# Altium project TASR1000.PrjPcb
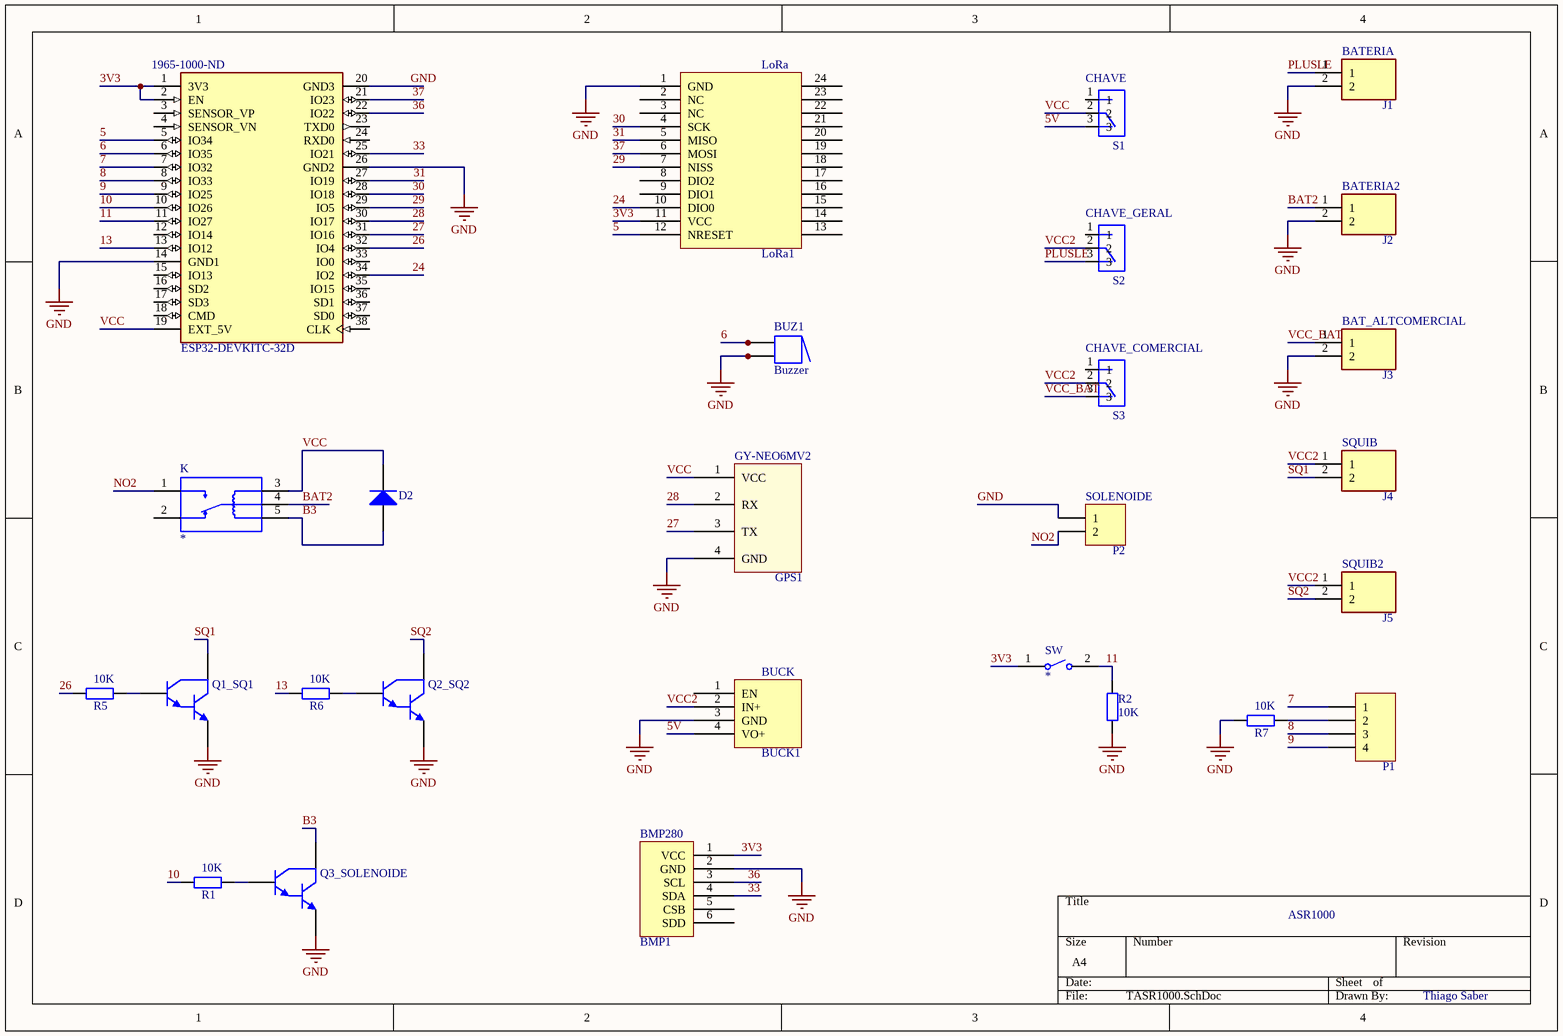
[diagram p0: TASR1000.SchDoc]
1 sheet, 27 parts. Net scope: global (net labels, ports and power ports of the same name join across sheets).
Board file: TASR1000.PcbDoc

## Sheet TASR1000.SchDoc: ASR1000
size A4; DrawnBy: Thiago Saber; Engineer: Thiago Duque Saber de Lima

### Parts
BMP1  BMP280  [BMP280]  (value not drawn)
BUCK1  Buck  [BUCK]  (value not drawn)
BUZ1  Buzzer  [ABSM-1574]
D2  Diode 1N4001  [DO-41]  (value not drawn)
GPS1  Modulo GPS GY-NEO6MV2  [GY-NEO6MV2]  (value not drawn)
J1  BATERIA  [JST_B2B-XH-A(LF)(SN)]
J2  BATERIA2  [JST_B2B-XH-A(LF)(SN)]
J3  BAT_ALTCOMERCIAL  [JST_B2B-XH-A(LF)(SN)]
J4  SQUIB  [JST_B2B-XH-A(LF)(SN)]
J5  SQUIB2  [JST_B2B-XH-A(LF)(SN)]
K  1-1721150-0  [RELAY_ORWH-SH-105D1F,000]  (value not drawn)
LoRa1  Modulo LoRa  [Suporte_Lora]  (value not drawn)
P1  Header 4  [HDR1X4]  (value not drawn)
P2  SOLENOIDE  [HDR1X2]
Q1_SQ1  NPN1  [TO-92]  (value not drawn)
Q2_SQ2  NPN1  [TO-92]  (value not drawn)
Q3_SOLENOIDE  NPN1  [TO-92]  (value not drawn)
R1  value 10K  [AXIAL-0.4]  (hidden comment: Resistor de Q2_SQ2)
R2  value 10K  [AXIAL-0.4]  (hidden comment: Resistor do header de 4 pinos)
R5  value 10K  [AXIAL-0.4]  (hidden comment: Resistor de Q1_SQ1)
R6  value 10K  [AXIAL-0.4]  (hidden comment: Resistor de Q2_SQ2)
R7  value 10K  [AXIAL-0.4]  (hidden comment: Resistor do header de 4 pinos)
S1  CHAVE  [SW_OS102011MS2QN1]
S2  CHAVE_GERAL  [SW_OS102011MS2QN1]
S3  CHAVE_COMERCIAL  [SW_OS102011MS2QN1]
SW  147694-1  [TE_FSM8JRT]  (value not drawn)
U  ESP32-DEVKITC-32D  Supplier Part Number 1: 1965-1000-ND  [MODULE_ESP32-DEVKITC-32D]

### Nets
GND: BMP1.2(GND) BUCK1.3(GND) BUZ1.2 BUZ1.2A GPS1.4(GND) J1.2 J2.2 J3.2 LoRa1.1(GND) P2.1 Q1_SQ1.3(E) Q2_SQ2.3(E) Q3_SOLENOIDE.3(E) R2.1 R7.1 U.14(GND1) U.20(GND3) U.26(GND2)
3V3: BMP1.1(VCC) LoRa1.11(VCC) SW.1 U.1(3V3) U.2(EN)
5: LoRa1.12(NRESET) U.5(IO34)
5V: BUCK1.4(VO+) S1.3
6: BUZ1.1 BUZ1.1A U.6(IO35)
7: P1.1 U.7(IO32)
8: P1.3 U.8(IO33)
9: P1.4 U.9(IO25)
10: R1.1 U.10(IO26)
11: R2.2 SW.2 U.11(IO27)
13: R6.1 U.13(IO12)
24: LoRa1.10(DIO0) U.34(IO2)
26: R5.1 U.32(IO4)
27: GPS1.3(TX) U.31(IO16)
28: GPS1.2(RX) U.30(IO17)
29: LoRa1.7(NISS) U.29(IO5)
30: LoRa1.4(SCK) U.28(IO18)
31: LoRa1.5(MISO) U.27(IO19)
33: BMP1.4(SDA) U.25(IO21)
36: BMP1.3(SCL) U.22(IO22)
37: LoRa1.6(MOSI) U.21(IO23)
B3: D2.1(A) K.5(C2) Q3_SOLENOIDE.1(C)
BAT2: J2.1 K.4(C)
NO2: K.1(NO) P2.2
PLUSLE: J1.1 S2.3
SQ1: J4.2 Q1_SQ1.1(C)
SQ2: J5.2 Q2_SQ2.1(C)
VCC: D2.2(K) GPS1.1(VCC) K.3(C1) S1.2 U.19(EXT_5V)
VCC2: BUCK1.2(IN+) J4.1 J5.1 S2.2 S3.2
VCC_BAT: J3.1 S3.3
NetP1_2: P1.2 R7.2
NetQ1_SQ1_2: Q1_SQ1.2(B) R5.2
NetQ2_SQ2_2: Q2_SQ2.2(B) R6.2
NetQ3_SOLENOIDE_2: Q3_SOLENOIDE.2(B) R1.2

Not connected (* = marked no-connect by the designer): BMP1 5(CSB) 6(SDD); BUCK1 1(EN); K 2(NC); LoRa1 2(NC) 3(NC) 8(DIO2) 9(DIO1) 13 14 15 16 17 18 19 20 21 22 23 24; S1 1; S2 1; S3 1; U 3(SENSOR_VP) 4(SENSOR_VN) 12(IO14) 15(IO13) 16(SD2) 17(SD3) 18(CMD) 23(TXD0) 24(RXD0) 33(IO0) 35(IO15) 36(SD1) 37(SD0) 38(CLK)

### Notes on the sheet
- (in symbol Buck) BUCK
- (in symbol Suporte Lora) LoRa

### Library data of the parts
BMP1 = BMP280: BMP280 usado no projeto ASR1000.
BUCK1 = Buck: Buck usado no projeto ASR1000.
BUZ1 = Buzzer: Magnetic Transducer Buzzer; Published: 24-Mar-1999; LatestRevisionDate: 17-Dec-2003; LatestRevisionNote: Schematic revised, PCB Footprint replaced.; DatasheetVersion: 17-Dec-2003; PackageReference: ABSM-1574; Publisher: Altium Limited; PackageDescription: Magnetic Transducer Buzzer; ComponentLink1Description: Manufacturer Link; ComponentLink1URL: http://www.megastar.com/linecard/buzzmode/index.php
D2 = Diode 1N4001: 1 Amp General Purpose Rectifier; Published: 8-Jun-2000; LatestRevisionDate: 17-Jul-2002; LatestRevisionNote: Re-released for DXP Platform.; DatasheetVersion: 1998; PackageVersion: Aug-1999; PackageReference: DO-41; Publisher: Altium Limited; PackageDescription: Diode, Axial; Body 5.2 x 2.7 mm (LxDia. max), Lead Dia. 0.86 mm (max); Code_JEDEC: DO-204-AL; ComponentLink1Description: Manufacturer Link; ComponentLink1URL: http://www.fairchildsemi.com/; ComponentLink2Description: Datasheet; ComponentLink2URL: http://www.fairchildsemi.com/ds/1N%2F1N4001.pdf
GPS1 = GY-NEO6MV2: Modulo GPS utilizado no projeto ASR1000.
J1-J5 = B2B-XH-A(LF)(SN): Connector Header Through Hole 2 position 0.098 _2.50mm_; MP: B2B-XH-A_LF__SN_; MF: JST Sales; Price: None; Package: None; Value: *; Availability: Unavailable; SnapEDA_Link: https://www.snapeda.com/parts/B2B-XH-A%28LF%29%28SN%29/JST%20Sales%20America%20Inc./view-part/492310/?ref=snap
K = ORWH-SH-105D1F,000: Electromechanical Relay 5VDC 15A SPDT __ 19.2mm 15.5mm 15mm__ THT General Purpose Relay; MF: TE Connectivity; Price: None; Value: *; TE_purchase_URL: https://www.te.com/usa-en/product-1-1721150-0.html?te_bu=Cor&te_type=disp&te_campaign=seda_glo_cor-seda-global-disp-prtnr-fy19-seda-model-bom-cta_sma-317_1&elqCampaignId=32493; Package: None; SnapEDA_Link: https://www.snapeda.com/parts/ORWH-SH-105D1F%2C000/TE%20Connectivity%20Potter%20%26%20Brumfield%20Relays/view-part/573992/?ref=snap; MP: ORWH-SH-105D1F,000; Availability: Unavailable; Comment_1: *
LoRa1 = Suporte Lora: LoRa usado no projeto ASR1000.
P1 = Header 4: Header, 4-Pin; LatestRevisionDate: 17-Jul-2002; LatestRevisionNote: Re-released for DXP Platform.; Publisher: Altium Limited
P2 = Header 2: Header, 2-Pin; LatestRevisionDate: 17-Jul-2002; LatestRevisionNote: Re-released for DXP Platform.; Publisher: Altium Limited
Q1_SQ1 Q2_SQ2 Q3_SOLENOIDE = NPN1: NPN Darlington Bipolar Transistor; Published: 8-Jun-2000; LatestRevisionDate: 17-Jul-2002; LatestRevisionNote: Re-released for DXP Platform.; DatasheetVersion: 1989; PackageVersion: 1989; PackageReference: TO-92; Publisher: Altium Limited; PackageDescription: TO, Flat Index; 3 In-Line, Axial Leads; Body Dia. 4.6mm; Leads 0.41 x 0.39 mm (max); Code_JEDEC: TO-92
R1 R2 R5-R7 = Res2: Resistor; Published: 8-Jun-2000; LatestRevisionDate: 17-Jul-2002; LatestRevisionNote: Re-released for DXP Platform.; PackageReference: AXIAL-0.4; Publisher: Altium Limited; PackageDescription: Axial Device, Thru-Hole; 2 Leads; 0.4 in Pin Spacing
S1-S3 = OS102011MS2QN1: Slide Switch SPDT Through Hole; MF: C&K; Price: None; Availability: Unavailable; Package: None; SnapEDA_Link: https://www.snapeda.com/parts/OS102011MS2QN1/C%26K/view-part/391519/?ref=snap; MP: OS102011MS2QN1; Value: *
SW = FSM8JRT: Switch Tactile OFF _ON_ SPST Round Button PC Pins 0.05A 12VDC 1.57N Thru-Hole Radial Tape; Contact_Current_Rating: 50 mA; MF: TE Connectivity; Configuration_Pole-Throw: Single Pole - Single Throw; Availability: Unavailable; Price: None; SnapEDA_Link: https://www.snapeda.com/parts/FSM8JRT/TE%20Connectivity%20ALCOSWITCH%20Switches/view-part/226999/?ref=snap; EU_RoHS_Compliance: Compliant; Value: *; Package: None; TE_purchase_URL: https://www.te.com/usa-en/product-147694-1.html?te_bu=Cor&te_type=disp&te_campaign=seda_glo_cor-seda-global-disp-prtnr-fy19-seda-model-bom-cta_sma-317_1&elqCampaignId=32493; MP: FSM8JRT; Comment_1: *
U = ESP32-DEVKITC-32D: - Transceiver; 802.11 b/g/n _Wi-Fi, WiFi, WLAN_, BluetoothÂ® Smart Ready 4.x Dual Mode For Use With ESP-WROOM-32; MF: Espressif Systems; Package: None; Price: None; Availability: Unavailable; MP: ESP32-DEVKITC-32D; SnapEDA_Link: https://www.snapeda.com/parts/ESP32-DEVKITC-32D/Espressif%20Systems/view-part/2777395/?ref=snap; Value: *; Supplier 1: Digi-Key